# EasyEDA Pro project ProPrj_电力电子综合设计_2025-07-04.epro, schematic Schematic1_1
Board Name: BOOST; Create Date: 2025-06-15; Page Name: P1; Project Name: 电力电子综合设计; Schematic Name: Schematic1_1; Update Date: 2025-06-18; Company: 嘉立创EDA; Page Size: A4; Version: V1.0
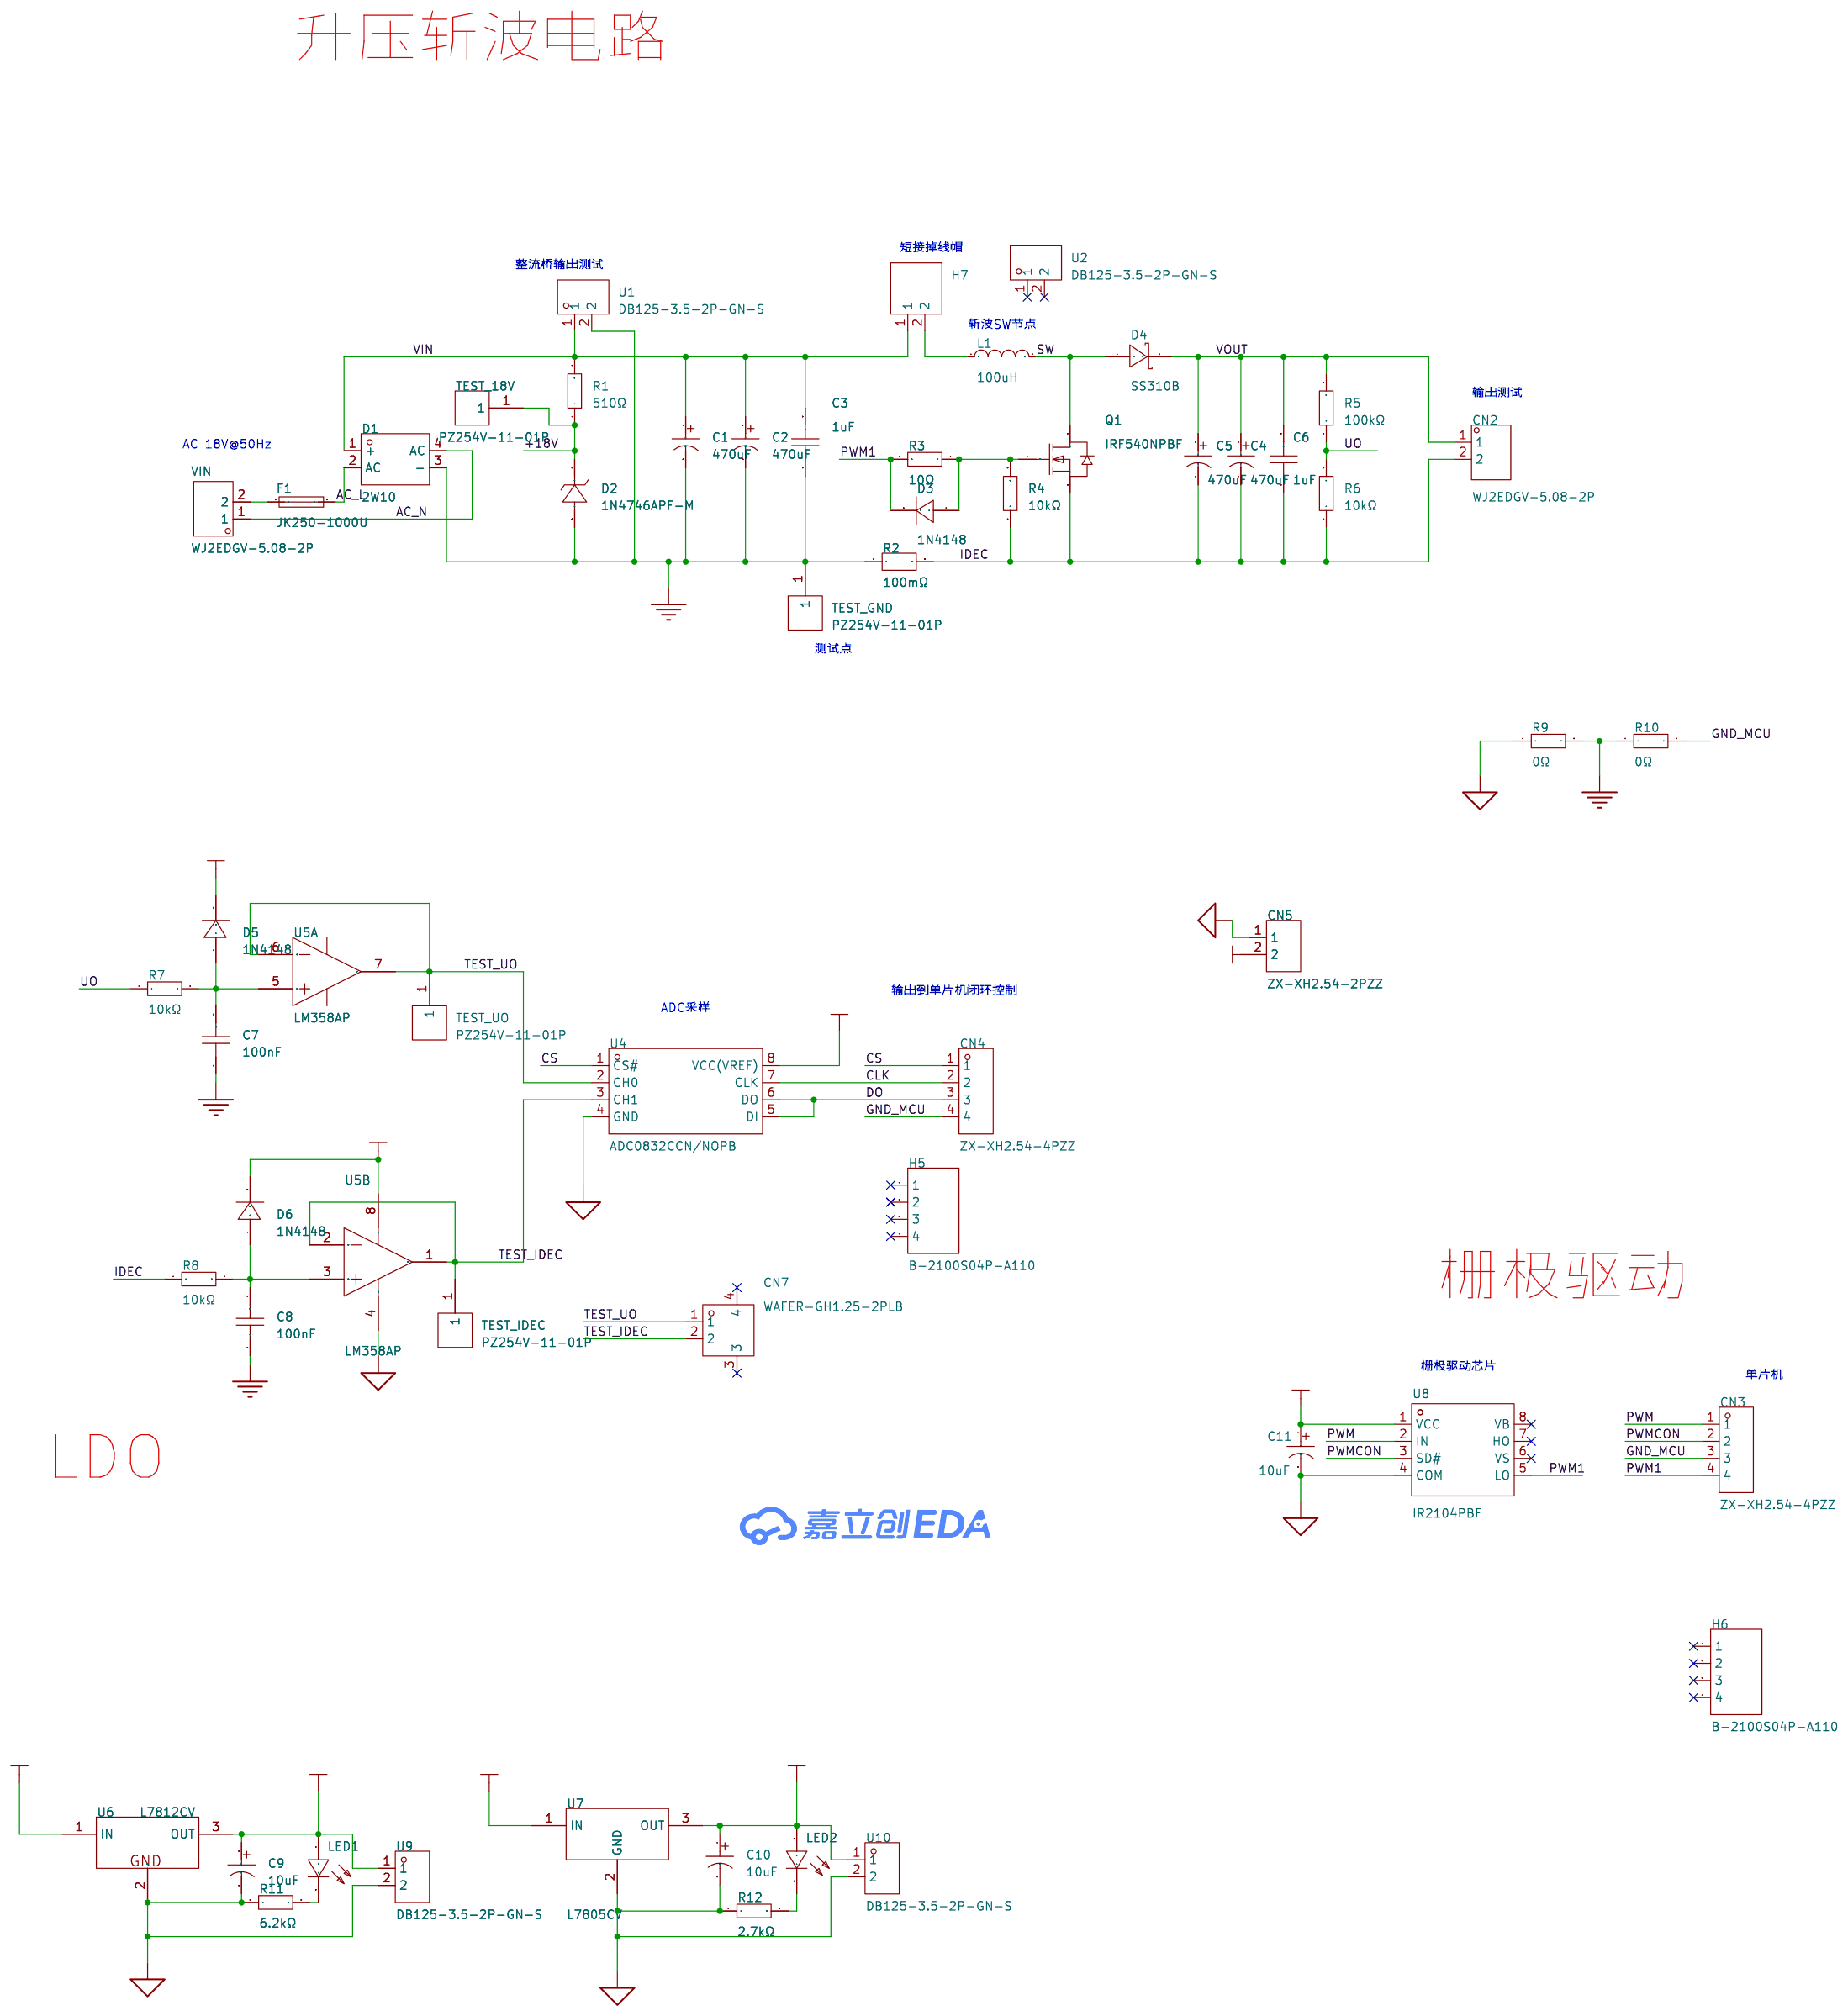
[diagram p1: schematic sheet]

## Parts
C1  470uF  [CAP-TH_BD16.0-P7.50-D1.2-FD]
C2  470uF  [CAP-TH_BD16.0-P7.50-D1.2-FD]
C3  1uF  [CAP-TH_L7.2-W6.0-P5.00-D0.6]
C4  470uF  [CAP-TH_BD16.0-P7.50-D1.2-FD]
C5  470uF  [CAP-TH_BD16.0-P7.50-D1.2-FD]
C6  1uF  [CAP-TH_L7.2-W6.0-P5.00-D0.6]
C7  100nF  [CAP-TH_L4.8-W3.2-P5.08-D1.2]
C8  100nF  [CAP-TH_L4.8-W3.2-P5.08-D1.2]
C9  10uF  [CAP-TH_BD5.0-P2.00-D0.8-FD]
C10  10uF  [CAP-TH_BD5.0-P2.00-D0.8-FD]
C11  10uF  [CAP-TH_BD5.0-P2.00-D0.8-FD]
CN2  WJ2EDGV-5.08-2P  [CONN-TH_WJ2EDGV-5.08-2P]
CN3  ZX-XH2.54-4PZZ  [CONN-TH_4P-P2.50_4PIN]
CN4  ZX-XH2.54-4PZZ  [CONN-TH_4P-P2.50_4PIN]
CN5  ZX-XH2.54-2PZZ  [CONN-TH_2P-P2.50_HX25003-2A]
CN7  WAFER-GH1.25-2PLB  [CONN-TH_2P-P1.25_XUNPU_WAFER-GH1.25-2PLB]
D1  2W10  [DIO-BG-TH_2W10]
D2  1N4746APF-M  [DO-41_BD2.8-L4.2-P8.20-D0.7-RD]
D3  1N4148  [DO-35_BD2.0-L4.0-P8.00-D0.5-FD]
D4  SS310B  [SMB_L4.6-W3.6-LS5.3-RD]
D5  1N4148  [DO-35_BD2.0-L4.0-P8.00-D0.5-FD]
D6  1N4148  [DO-35_BD2.0-L4.0-P8.00-D0.5-FD]
F1  JK250-1000U  [FUSE-TH_L20.0-W4.5-P5.10-D0.8-S3.00]
H5  B-2100S04P-A110  [HDR-TH_4P-P2.54-V-M]  (no BOM)
H6  B-2100S04P-A110  [HDR-TH_4P-P2.54-V-M]  (no BOM)
H7  -  [HDR-TH_2P-P2.54-V-M-1]
L1  100uH  [IND-SMD_L10.6-W10.2]
LED1  204-10SUGD/S400-A5  [LED-TH_BD3.0-P2.54-FD-GREEN]
LED2  204-10SUGD/S400-A5  [LED-TH_BD3.0-P2.54-FD-GREEN]
Q1  IRF540NPBF  [TO-220-3_L10.0-W4.5-P2.54-L]
R1  510Ω  [RES-TH_BD2.3-L6.5-P10.50-D0.5]
R2  100mΩ  [RES-TH_BD5.0-L15.5-P19.50-D0.7]
R3  10Ω  [RES-TH_BD2.4-L6.3-P10.30-D0.6]
R4  10kΩ  [RES-TH_BD2.3-L6.5-P10.50-D0.5]
R5  100kΩ  [RES-TH_BD2.5-L6.5-P10.50-D0.6]
R6  10kΩ  [RES-TH_BD2.3-L6.5-P10.50-D0.5]
R7  10kΩ  [RES-TH_BD2.3-L6.5-P10.50-D0.5]
R8  10kΩ  [RES-TH_BD2.3-L6.5-P10.50-D0.5]
R9  0Ω  [RES-TH_BD2.5-L6.5-P10.50-D0.6]
R10  0Ω  [RES-TH_BD2.5-L6.5-P10.50-D0.6]
R11  6.2kΩ  [RES-TH_BD2.2-L6.5-P10.50-D0.6]
R12  2.7kΩ  [RES-TH_BD2.5-L6.5-P10.50-D0.6]
TEST_18V  PZ254V-11-01P  [HDR-TH_1P-P2.54-V-M]
TEST_GND  PZ254V-11-01P  [HDR-TH_1P-P2.54-V-M]
TEST_IDEC  PZ254V-11-01P  [HDR-TH_1P-P2.54-V-M]
TEST_UO  PZ254V-11-01P  [HDR-TH_1P-P2.54-V-M]
U1  DB125-3.5-2P-GN-S  [CONN-TH_2P-P3.50_L7.4-W7.0]
U2  DB125-3.5-2P-GN-S  [CONN-TH_2P-P3.50_L7.4-W7.0]  (no BOM)
U4  ADC0832CCN/NOPB  [PDIP-8_L9.6-W6.4-P2.54-LS7.6-BL]
U5  LM358AP  [DIP-8_L9.7-W6.4-P2.54-LS7.6-BL]  (sections 1,2)
U6  L7812CV  [TO-220-3_L10.0-W4.5-P2.54-L]
U7  L7805CV  [TO-220-3_L10.0-W4.5-P2.54-L]
U8  IR2104PBF  [DIP-8_L9.9-W6.6-P2.54-LS7.62-BL]
U9  DB125-3.5-2P-GN-S  [CONN-TH_2P-P3.50_L7.4-W7.0]
U10  DB125-3.5-2P-GN-S  [CONN-TH_2P-P3.50_L7.4-W7.0]
VIN  WJ2EDGV-5.08-2P  [CONN-TH_WJ2EDGV-5.08-2P]

## Library data of the parts
C1 C2 C4 C5 = KM477M100K25RR0VH2FP0: 容值:470uF;精度:±20%;额定电压:100V;; LCSC Part Name: 470uF ±20% 100V; Supplier Part: C72551; Manufacturer: CX(承兴); Supplier Footprint: 插件,D16xL25mm; JLCPCB Part Class: 扩展库; Datasheet: https://atta.szlcsc.com/upload/public/pdf/source/20211027/06D6BA3719C264B639DC286D935D03EA.pdf; Supplier: LCSC; Tolerance: ±20%; Voltage Rating: 100V; Pin Spacing: 7.5mm; Diameter: 16mm; Height - Seated (Max): 25mm
C3 C6 = PE105J2A0501: 容值:1uF;精度:±5%;额定电压:100V;介电材料:金属化聚酯;工作温度:-40℃~+85℃;; LCSC Part Name: 1uF ±5% 100V; Supplier Part: C390180; Manufacturer: KYET(科雅); Supplier Footprint: 插件,P=5mm; JLCPCB Part Class: 扩展库; Datasheet: https://atta.szlcsc.com/upload/public/pdf/source/20250227/127161F181C047328E5CCC3478FF3F3E.pdf; Supplier: LCSC; Tolerance: ±5%; Voltage Rating: 100V; Dielectric Material: 金属化聚酯; Operating Temperature: -40℃~+85℃
C7 C8 = CT4G-0805-2X1-50V-0.1μF-K: 容值:100nF;精度:±10%;额定电压:50V;温度系数:-;; LCSC Part Name: 100nF ±10% 50V; Supplier Part: C141981; Manufacturer: TORCH(火炬); Supplier Footprint: 插件,P=5.08mm; JLCPCB Part Class: 扩展库; Datasheet: https://atta.szlcsc.com/upload/public/pdf/source/20180620/C141981_0E4048852A6BFF96618422C8126500A5.pdf; Supplier: LCSC; Tolerance: ±10%; Voltage Rating: 50V
C9-C11 = KF100M035C110A: 容值:10uF;精度:±20%;额定电压:35V;; LCSC Part Name: 10uF ±20% 35V; Supplier Part: C62621; Manufacturer: CapXon(丰宾); Supplier Footprint: 插件,D5xL11mm; JLCPCB Part Class: 扩展库; Datasheet: https://atta.szlcsc.com/upload/public/pdf/source/20151126/1457707596840.pdf; Supplier: LCSC; Tolerance: ±20%; Voltage Rating: 35V; Pin Spacing: 2mm; Diameter: 5mm; Height - Seated (Max): 11mm; Lifetime: 2000hrs@105℃
CN2 VIN = WJ2EDGV-5.08-2P: 连接器类型:板端/插座-开口;固定方式:-;结构:1x2P;间距:5.08mm;颜色:绿色;安装方式:直针;排数:1;每排PIN数:2;额定电流:20A;额定电压:450V;线规 - AWG:-;线规 - 平方毫米:-;触头材质:黄铜;触头镀层:锡;工作温度范围:-40℃~+105℃;焊接温度(最大值):-;; LCSC Part Name: 1x2P 5.08mm 排数:1 每排P数:2; Supplier Part: C8461; Manufacturer: KANGNEX(康奈克斯电气); Supplier Footprint: 插件,P=5.08mm; JLCPCB Part Class: 扩展库; Datasheet: https://atta.szlcsc.com/upload/public/pdf/source/20191225/C8461_177EB00EC60F9C1AD12B590D31C8666C.pdf; Supplier: LCSC; Connector Type: 板端/插座-开口; Structure: 1x2P; Pitch: 5.08mm; Color: 绿色; Mounting Style: 直针; Number of Pins: 2P; Number of Rows: 1; Number of PINs Per Row: 2; Current Rating (Max): 20A; Voltage Rating (Max): 450V; Contact Material: 黄铜; Contact Plating: 锡; Operating Temperature Range: -40℃~+105℃
CN3 CN4 = ZX-XH2.54-4PZZ: 插针结构:1x4P;间距:2.5mm;安装方式:直插;参考系列:XH;总PIN数:4P;排数:1;每排PIN数:4;行距:-;额定电流:3A;触头材质:黄铜;触头镀层:锡;工作温度范围:-25℃~+85℃;; LCSC Part Name: 1x4P 间距:2.5mm 直插 系列:XH; Supplier Part: C7429634; Manufacturer: Megastar(兆星); Supplier Footprint: 插件,P=2.5mm; JLCPCB Part Class: 扩展库; Datasheet: https://atta.szlcsc.com/upload/public/pdf/source/20230619/B529A2163E0159A644AB3383D208FB03.pdf; Supplier: LCSC; Pins Structure: 1x4P; Pitch: 2.5mm; Mounting Type: 直插; Reference Series: XH; Number of Pins: 4P; Number of Rows: 1; Number of PINs Per Row: 4; Rated Current: 3A; Contact Material: 黄铜; Contact Plating: 锡; Operating Temperature: -25℃~+85℃; Rated Voltage (Max): 250V; Plastic Material: PA66; Flame Retardant Rating: UL94V-0; Color: 白色; Z-Height of the Board: 7mm; X-Length of Bottom Edge on Board (Spacing Line): 12.5mm; Y-Width of Bottom Edge on Board: 5.9mm
CN5 = ZX-XH2.54-2PZZ: 插针结构:1x2P;间距:2.5mm;安装方式:直插;参考系列:XH;总PIN数:2P;排数:1;每排PIN数:2;行距:-;额定电流:3A;触头材质:黄铜;触头镀层:锡;工作温度范围:-25℃~+85℃;; LCSC Part Name: 1x2P 间距:2.5mm 直插 系列:XH; Supplier Part: C7429632; Manufacturer: Megastar(兆星); Supplier Footprint: 插件,P=2.5mm; JLCPCB Part Class: 扩展库; Datasheet: https://atta.szlcsc.com/upload/public/pdf/source/20230619/19BA6947230AA44A04D3EDD65E618FD0.pdf; Supplier: LCSC; Pins Structure: 1x2P; Pitch: 2.5mm; Mounting Type: 直插; Reference Series: XH; Number of Pins: 2P; Number of Rows: 1; Number of PINs Per Row: 2; Rated Current: 3A; Contact Material: 黄铜; Contact Plating: 锡; Operating Temperature: -25℃~+85℃; Rated Voltage (Max): 250V; Plastic Material: PA66; Flame Retardant Rating: UL94V-0; Color: 白色; Z-Height of the Board: 7mm; X-Length of Bottom Edge on Board (Spacing Line): 7.5mm; Y-Width of Bottom Edge on Board: 5.9mm
CN7 = WAFER-GH1.25-2PLB: 插针结构:1x2P;间距:1.25mm;安装方式:立贴;参考系列:GH;总PIN数:2P;排数:1;每排PIN数:2;行距:-;额定电流:1A;触头材质:黄铜;触头镀层:-;工作温度:-25℃~+85℃;; LCSC Part Name: 1x2P 间距:1.25mm 立贴 系列:GH; Supplier Part: C3029368; Manufacturer: XUNPU(讯普); Supplier Footprint: SMD,P=1.25mm; JLCPCB Part Class: 扩展库; Datasheet: https://atta.szlcsc.com/upload/public/pdf/source/20220527/44F824AAC8C2B617205E15955FF9C23D.pdf; Supplier: LCSC; Pins Structure: 1x2P; Pitch: 1.25mm; Mounting Type: 立贴; Reference Series: GH; Number of Pins: 2P; Number of Rows: 1; Number of PINs Per Row: 2; Current Rating: 1A; Contact Material: 黄铜; Operating Temperature: -25℃~+85℃; Voltage Rating: 125V; Plastic Material: LCP; Supplementary Features: 辅助焊脚; Color: 米色; Z-Height of the Board: 4.2mm; X-Length of Bottom Edge on Board (Spacing Line): 5.75mm; Y-Width of Bottom Edge on Board: 4.95mm
D1 = 2W10_C3064: 正向压降(Vf):1V@2A;直流反向耐压(Vr):1kV;整流电流:2A;正向浪涌电流(Ifsm):50A;; Supplier Part: C3064; Manufacturer: MDD(辰达半导体); Supplier Footprint: WOM; JLCPCB Part Class: 扩展库; Datasheet: https://atta.szlcsc.com/upload/public/pdf/source/20240809/6BA6F435CD69DB5BCB9EE3C8732FD91E.pdf; Supplier: LCSC; Voltage - Forward(Vf@If): 1V@2A; Voltage - DC Reverse(Vr): 1kV; Current - Rectified: 2A; Reverse Leakage Current (Ir): 10uA@1kV; Peak Forward Surge Current: 50A; Operating Temperature: -55℃~+125℃@(Tj)
D2 = 1N4746APF-M: Supplier Part: C7497924; Manufacturer: ST(先科); Supplier Footprint: DO-41; JLCPCB Part Class: 扩展库; Datasheet: https://atta.szlcsc.com/upload/public/pdf/source/20230815/F3027D200352FBEA986FB06BDB48B800.pdf; Supplier: LCSC
D3 D5 D6 = 1N4148_C14516: 二极管配置:-;正向压降(Vf):1V@10mA;直流反向耐压(Vr):75V;整流电流:-;反向恢复时间(Trr):-;; Supplier Part: C14516; Manufacturer: ST(先科); Supplier Footprint: DO-35; JLCPCB Part Class: 扩展库; Datasheet: https://atta.szlcsc.com/upload/public/pdf/source/20140303/1457707005030.pdf; Supplier: LCSC; Voltage - Forward(Vf@If): 1V@10mA; Voltage - DC Reverse(Vr): 75V; Reverse Leakage Current (Ir): 5uA@75V
D4 = SS310B_C14281: 二极管配置:独立式;正向压降(Vf):850mV@3A;直流反向耐压(Vr):100V;整流电流:3A;; LCSC Part Name: 电压:100V 电流:3A; Supplier Part: C14281; Manufacturer: MDD(辰达半导体); Supplier Footprint: SMB(DO-214AA); JLCPCB Part Class: 扩展库; Datasheet: https://atta.szlcsc.com/upload/public/pdf/source/20241121/2D46770803966DF119171D1C653E29F2.pdf; Supplier: LCSC; Diode Configuration: 独立式; Voltage - Forward(Vf@If): 850mV@3A; Voltage - DC Reverse(Vr): 100V; Current - Rectified: 3A; Reverse Leakage Current (Ir): 300uA@100V
F1 = JK250-1000U: 耐压:250V;最大电流:7A;保持电流(Ih):1A;跳闸电流:2A;; LCSC Part Name: 250V 1A 插件自恢复; Supplier Part: C369137; Manufacturer: JK(金科); Supplier Footprint: 插件,P=5.1mm; JLCPCB Part Class: 扩展库; Datasheet: https://atta.szlcsc.com/upload/public/pdf/source/20190729/C369139_C08718BF598B8E672A40D8E717FCB467.pdf; Supplier: LCSC; Voltage - Max: 250V; Current - Max: 7A; Hold Current: 1A; Trip Current: 2A; Time to Trip(Max): 20s
H5 H6 = B-2100S04P-A110: 插针结构:1x4P;间距:2.54mm;行距:-;圆针/方针:-;安装方式:直插;排数:单排;总PIN位数:4P;额定电流:-;额定电压:-;配合针长度:6mm;塑高:2.54mm;端接针长度:3mm;触头材质:黄铜;触头镀层:-;工作温度:-40℃~+105℃;颜色:黑色;; LCSC Part Name: 1x4P 间距:2.54mm 直插; Supplier Part: C124378; Manufacturer: Ckmtw(灿科盟); Supplier Footprint: 插件,P=2.54mm; JLCPCB Part Class: 扩展库; Datasheet: https://atta.szlcsc.com/upload/public/pdf/source/20170821/C124381_1503303309126901535.pdf; Supplier: LCSC; Pin Structure: 1x4P; Pitch: 2.54mm; Mounting Type: 直插; Number of Rows: 单排; Number of Pins: 4P; Length of Mating Pin: 6mm; Insulation Height: 2.54mm; Length of End Connection Pin: 3mm; Contact Material: 黄铜; Operating Temperature: -40℃~+105℃; Color: 黑色
H7 = HDR-M_2.54_1x2P: Supplier Part: C124375; Supplier Footprint: 插件
L1 = PSPMAC1045H-101M-ANP: 电感值:100uH;精度:±20%;额定电流:2A;饱和电流(Isat):4A;; LCSC Part Name: 100uH ±20% 4A; Supplier Part: C436577; Manufacturer: PROD(谱罗德); Supplier Footprint: SMD,11x10mm; JLCPCB Part Class: 扩展库; Datasheet: https://atta.szlcsc.com/upload/public/pdf/source/20200813/C436577_6C03ADCEB86EDF89C439410E6AAFAED5.pdf; Supplier: LCSC; Tolerance: ±20%; Rated Current: 2A; Saturation Current (Isat): 4A; DC Resistance (DCR): 300mΩ; Ratings: AEC-Q200
LED1 LED2 = 204-10SUGD/S400-A5: 灯头类型:3mm圆形灯头;发光颜色:翠绿色;功率:110mW;正向电流:20mA;主波长:530nm;二极管配置:-;透镜颜色:雾状绿透镜;色温:-;发光角度:30°;载带方式:-;工作温度:-40℃~+85℃;; LCSC Part Name: 翠绿; Supplier Part: C99761; Manufacturer: EVERLIGHT(亿光); Supplier Footprint: 插件,D=3mm; JLCPCB Part Class: Extended Part; Datasheet: https://atta.szlcsc.com/upload/public/pdf/source/20231222/11ECFE5D50388BB9885CDCD9350FD859.pdf; Supplier: LCSC; Lamp Holder Type: 3mm圆形灯头; Emitted Color: 翠绿色; Power Dissipation: 110mW; Forward Current: 20mA; Dominant Wavelength: 530nm; Peak Wavelength: 525nm; Lens Color: 雾状绿透镜; Viewing Angle: 30°; Operating Temperature: -40℃~+85℃
Q1 = IRF540NPBF: 类型:1个N沟道;漏源电压(Vdss):100V;连续漏极电流(Id):33A;导通电阻(RDS(on)@Vgs,Id):44mΩ@10V,16A;功率(Pd):130W;阈值电压(Vgs(th)@Id):4V@250uA;; LCSC Part Name: 1个N沟道 耐压:100V 电流:33A; Supplier Part: C2566; Manufacturer: Infineon(英飞凌); Supplier Footprint: TO-220AB; JLCPCB Part Class: Extended Part; Datasheet: https://atta.szlcsc.com/upload/public/pdf/source/20140818/1457707225950.pdf; Supplier: LCSC; Type: 1个N沟道; Drain Source Voltage (Vdss): 100V; Continuous Drain Current (Id): 33A; Drain Source On Resistance (RDS(on)@Vgs,Id): 44mΩ@10V,16A; Power Dissipation (Pd): 130W; Gate Threshold Voltage (Vgs(th)@Id): 4V@250uA; Total Gate Charge (Qg@Vgs): 71nC; Input Capacitance (Ciss@Vds): 1.96nF; Reverse Transfer Capacitance (Crss@Vds): 40pF; Operating Temperature: -55℃~+175℃
R1 = MF1/4W-510Ω±1% T: 电阻类型:金属膜电阻;阻值:510Ω;精度:±1%;功率:250mW;温度系数:±100ppm/℃;; LCSC Part Name: 510Ω ±1% 250mW 金属膜电阻; Supplier Part: C119318; Manufacturer: CCO(千志电子); Supplier Footprint: 插件,D2.3xL6.5mm; JLCPCB Part Class: 扩展库; Datasheet: https://atta.szlcsc.com/upload/public/pdf/source/20190910/C427326_62A6D058BC0FF74963A2F22379CA06CE.pdf; Supplier: LCSC; Type: 金属膜电阻; Tolerance: ±1%; Voltage-Supply(Max): 250V; Power(Watts): 250mW; Temperature Coefficient: ±100ppm/℃; Operating Temperature: -55℃~+155℃
R2 = MF3WS-0.1Ω±1%T: 电阻类型:金属膜电阻;阻值:100mΩ;精度:±1%;功率:3W;温度系数:±200ppm/℃;; LCSC Part Name: 金属膜电阻 100mΩ ±1% 3W; Supplier Part: C714162; Manufacturer: 华星机电; Supplier Footprint: 插件,D5xL15.5mm; JLCPCB Part Class: 扩展库; Datasheet: https://atta.szlcsc.com/upload/public/pdf/source/20200731/C713882_AE8EB1102749D7E4FB4FB13DC898C429.pdf; Supplier: LCSC; Type: 金属膜电阻; Tolerance: ±1%; Power(Watts): 3W; Temperature Coefficient: ±200ppm/℃
R3 = MFR-25JT-52-10R: 电阻类型:金属膜电阻;阻值:10Ω;精度:±5%;功率:250mW;; LCSC Part Name: 金属膜电阻 10Ω ±5% 250mW 铜脚，圆柱状直插; Supplier Part: C176452; Manufacturer: YAGEO(国巨); Supplier Footprint: 插件,D2.4xL6.3mm; JLCPCB Part Class: 扩展库; Datasheet: https://atta.szlcsc.com/upload/public/pdf/source/20191118/C457825_18355E864DE4965678DC27B0EBC3E21E.pdf; Supplier: LCSC; Type: 金属膜电阻; Tolerance: ±5%; Power(Watts): 250mW; Operating Temperature: -55℃~+155℃
R4 R6-R8 = MF1/4W-10KΩ±1% T: 电阻类型:金属膜电阻;阻值:10kΩ;精度:±1%;功率:250mW;温度系数:±100ppm/℃;; LCSC Part Name: 10kΩ ±1% 250mW 金属膜电阻 圆柱状直插; Supplier Part: C119347; Manufacturer: CCO(千志电子); Supplier Footprint: 插件,D2.3xL6.5mm; JLCPCB Part Class: 扩展库; Datasheet: https://atta.szlcsc.com/upload/public/pdf/source/20190910/C427326_62A6D058BC0FF74963A2F22379CA06CE.pdf; Supplier: LCSC; Type: 金属膜电阻; Tolerance: ±1%; Voltage-Supply(Max): 250V; Power(Watts): 250mW; Temperature Coefficient: ±100ppm/℃; Operating Temperature: -55℃~+155℃
R5 = MFR0W4F1003A50: 电阻类型:金属膜电阻;阻值:100kΩ;精度:±1%;功率:250mW;温度系数:±50ppm/℃;; LCSC Part Name: 100kΩ ±1% 250mW 金属膜电阻 铜脚，圆柱状直插; Supplier Part: C58597; Manufacturer: UNI-ROYAL(厚声); Supplier Footprint: 插件,D2.2xL6.5mm; JLCPCB Part Class: 扩展库; Datasheet: https://atta.szlcsc.com/upload/public/pdf/source/20191012/C436293_8820AA14BC71FA35E551C06C441482A0.pdf; Supplier: LCSC; Type: 金属膜电阻; Tolerance: ±1%; Voltage-Supply(Max): 250V; Power(Watts): 250mW; Temperature Coefficient: ±50ppm/℃
R9 R10 = RN1/4W0RT/BA1: 电阻类型:金属膜电阻;阻值:0Ω;精度:±1%;功率:250mW;; LCSC Part Name: 金属膜电阻 0Ω ±1% 250mW; Supplier Part: C410698; Manufacturer: Tyohm(幸亚电阻); Supplier Footprint: 插件,D2.4xL6.5mm; JLCPCB Part Class: 扩展库; Datasheet: https://atta.szlcsc.com/upload/public/pdf/source/20190808/C410699_D126E64D28B638F1D73B58E9F61DFD9B.pdf; Supplier: LCSC; Type: 金属膜电阻; Tolerance: ±1%; Power(Watts): 250mW
R11 = MFR0W4F6201A50: 电阻类型:金属膜电阻;阻值:6.2kΩ;精度:±1%;功率:250mW;温度系数:±50ppm/℃;; LCSC Part Name: 6.2kΩ ±1% 250mW 金属膜电阻 铜脚，圆柱状直插; Supplier Part: C61652; Manufacturer: UNI-ROYAL(厚声); Supplier Footprint: 插件,D2.2xL6.5mm; JLCPCB Part Class: 扩展库; Datasheet: https://atta.szlcsc.com/upload/public/pdf/source/20191012/C436293_8820AA14BC71FA35E551C06C441482A0.pdf; Supplier: LCSC; Type: 金属膜电阻; Tolerance: ±1%; Voltage-Supply(Max): 250V; Power(Watts): 250mW; Temperature Coefficient: ±50ppm/℃
R12 = MFR0W4F2701A50: 电阻类型:金属膜电阻;阻值:2.7kΩ;精度:±1%;功率:250mW;温度系数:±50ppm/℃;; LCSC Part Name: 2.7kΩ ±1% 250mW 金属膜电阻; Supplier Part: C58615; Manufacturer: UNI-ROYAL(厚声); Supplier Footprint: 插件,D2.2xL6.5mm; JLCPCB Part Class: 扩展库; Datasheet: https://atta.szlcsc.com/upload/public/pdf/source/20191012/C436293_8820AA14BC71FA35E551C06C441482A0.pdf; Supplier: LCSC; Type: 金属膜电阻; Tolerance: ±1%; Voltage-Supply(Max): 250V; Power(Watts): 250mW; Temperature Coefficient: ±50ppm/℃
TEST_18V TEST_GND TEST_IDEC TEST_UO = PZ254V-11-01P: 插针结构:1x1P;间距:2.54mm;行距:-;圆针/方针:方针;安装方式:直插;排数:单排;总PIN位数:1P;额定电流:-;额定电压:-;配合针长度:6mm;塑高:2.5mm;端接针长度:3mm;触头材质:黄铜;触头镀层:-;工作温度:-40℃~+105℃;颜色:黑色;; LCSC Part Name: 1x1P 间距:2.54mm 方针 直插; Supplier Part: C492400; Manufacturer: XFCN(兴飞); Supplier Footprint: 插件,P=2.54mm; JLCPCB Part Class: 扩展库; Datasheet: https://atta.szlcsc.com/upload/public/pdf/source/20200309/C492400_46876A5B545F5AE6B8D4A09C46E276E8.pdf; Supplier: LCSC; Pin Structure: 1x1P; Pitch: 2.54mm; Circluar Pins/Square Pins: 方针; Mounting Type: 直插; Number of Rows: 单排; Number of Pins: 1P; Length of Mating Pin: 6mm; Insulation Height: 2.5mm; Length of End Connection Pin: 3mm; Contact Material: 黄铜; Operating Temperature: -40℃~+105℃; Color: 黑色
U1 U2 U9 U10 = DB125-3.5-2P-GN-S: 结构:1x2P;间距:3.5mm;颜色:绿色;安装方式:直插;排数:1;每排PIN数:2;额定电流:10A;额定电压:300V;线规 - AWG:16~28;线规 - 平方毫米:1;工作温度:-40℃~+105℃;; LCSC Part Name: 1x2P 3.5mm 直插 排数:1 每排P数:2; Supplier Part: C466970; Manufacturer: DORABO(地博电气); Supplier Footprint: 插件,P=3.5mm; JLCPCB Part Class: 扩展库; Datasheet: https://atta.szlcsc.com/upload/public/pdf/source/20221227/3B943AA1CFCAE24F1BA4E72404938A89.pdf; Supplier: LCSC; Number of Positions or Pins: 1x2P; Pitch: 3.5mm; Color: 绿色; Mounting Type: 直插; Number of Pins: 2P; Number of Rows: 1; Number of PINs Per Row: 2; Screw Specification: M2; Current Rating: 10A; Voltage Rating (Max): 300V; Wire Gauge - AWG: 16~28; Wire Gauge - mm2: 1; Operating Temperature: -40℃~+105℃
U4 = ADC0832CCN/NOPB: 分辨率:8位;采样率:-;工作电压:4.5V~6.3V;接口类型:MICROWIRE;; LCSC Part Name: ADC0832CCN/NOPB 停产; Supplier Part: C385862; Manufacturer: TI(德州仪器); Supplier Footprint: PDIP-8; JLCPCB Part Class: 扩展库; Datasheet: https://www.ti.com/cn/lit/gpn/adc0832-n; Supplier: LCSC; resolution: 8位; number of channels: 2; Supply Voltage: 4.5V~6.3V; Interface: MICROWIRE; differential input: 是; Integral nonlinearity: 1LSB; Operating Temperature: -40℃~+85℃
U5 = LM358AP: 放大器数:双路;增益带宽积(GBP):700kHz;输入偏置电流(Ib):15nA;压摆率(SR):0.3V/us;带宽(-3db):-;; LCSC Part Name: 行业标准双路运算放大器; Supplier Part: C163528; Manufacturer: TI(德州仪器); Supplier Footprint: DIP-8; JLCPCB Part Class: 扩展库; Datasheet: https://www.ti.com/cn/lit/gpn/lm358a; Supplier: LCSC; Number of Circuits: 双路; Gain Bandwidth Product(GBP): 700kHz; Current - Input Bias(Ib): 15nA; Slew Rate(SR): 0.3V/us; Output Current: 40mA; Operating Temperature: 0℃~+70℃
U6 = L7812CV_C519078: 输出类型:固定;工作电压:35V;输出电压:12V;输出电流:1.2A;电源纹波抑制比(PSRR):71dB@(120Hz);输出极性:正极;; LCSC Part Name: 1.2A 宽输入电压固定电压稳压器; Supplier Part: C519078; Manufacturer: HGC(华冠); Supplier Footprint: TO-220; JLCPCB Part Class: 扩展库; Datasheet: https://atta.szlcsc.com/upload/public/pdf/source/20200427/C519075_B339EB95789D71CBB6AC413ABED62D06.pdf; Supplier: LCSC; Output Type: 固定; Voltage - Supply: 35V; Output Voltage: 12V; Output Current: 1.2A; Power Supply Rejection Ratio (PSRR): 71dB@(120Hz); Operating Temperature: 0℃~+125℃@(Tj); Output Configuration: 正极; Number of Outputs: 1
U7 = L7805CV: 输出类型:固定;工作电压:35V;输出电压:5V;输出电流:1.5A;电源纹波抑制比(PSRR):62dB@(120Hz);输出极性:正极;; LCSC Part Name: 正稳压器IC; Supplier Part: C111887; Manufacturer: ST(意法半导体); Supplier Footprint: TO-220; JLCPCB Part Class: 扩展库; Datasheet: https://atta.szlcsc.com/upload/public/pdf/source/20180606/C192854_20B6D8F8F52B6FFCE5644906251095FD.pdf; Supplier: LCSC; Output Type: 固定; Maximum Input Voltage: 35V; Output Voltage: 5V; Output Current: 1.5A; Power Supply Rejection Ratio (PSRR): 62dB@(120Hz); Dropout Voltage: 2V@(1A); standby current: 8mA; Feature: 短路保护；热保护(TSD)；过流保护(OCP); Operating Temperature: 0℃~+125℃; Output Polarity: 正极; Number of Outputs: 1
U8 = IR2104PBF: 驱动配置:半桥;负载类型:MOSFET；IGBT;驱动通道数:2;峰值灌电流:360mA;峰值拉电流:210mA;电源电压:10V~20V;上升时间:100ns;下降时间:50ns;; LCSC Part Name: IR2104PBF 停产; Supplier Part: C2959; Manufacturer: Infineon(英飞凌); Supplier Footprint: PDIP-8; JLCPCB Part Class: 扩展库; Datasheet: https://atta.szlcsc.com/upload/public/pdf/source/20140906/1457707236579.pdf; Supplier: LCSC; Driven Configuration: 半桥; Load Type: MOSFET；IGBT; Number of Drivers: 2; Peak Output Current(sink): 360mA; Peak Output Current(source): 210mA; Supply Voltage: 10V~20V; Rise Time: 100ns; Fall Time: 50ns; Operating Temperature: -40℃~+150℃@(Tj)

## Nets
+5V: C10.1 CN5.2 D5.2(C) D6.2(C) LED2.1(A) U4.8(VCC(VREF)) U5.8(VCC) U7.3(OUT) U10.1
+12V: C9.1 C11.1 LED1.1(A) U6.3(OUT) U7.1(IN) U8.1(VCC) U9.1
+18V: D2.1(K) R1.1 TEST_18V.1 U6.1(IN)
AGND: C9.2 C10.2 C11.2 CN5.1 R9.1 R11.1 R12.1 U4.4(GND) U5.4(GND) U6.2(GND) U7.2(GND) U8.4(COM) U9.2 U10.2
GND: C1.2 C2.2 C3.1 C7.1 C8.1 D1.3(-) D2.2(A) R2.1 R9.2 R10.1 TEST_GND.1 U1.2
GND_MCU: CN3.3 CN4.4 R10.2
VIN: C1.1 C2.1 C3.2 D1.1(+) H7.1 R1.2 U1.1
AC_L: D1.2(AC) F1.2
AC_N: D1.4(AC) VIN.1
CLK: CN4.2 U4.7(CLK)
CS: CN4.1 U4.1(CS#)
DO: CN4.3 U4.5(DI) U4.6(DO)
IDEC: C4.2 C5.2 C6.1 CN2.2 Q1.3(S) R2.2 R4.1 R6.1 R8.1
PWM: CN3.1 U8.2(IN)
PWM1: CN3.4 D3.2(C) R3.1 U8.5(LO)
PWMCON: CN3.2 U8.3(SD#)
SW: D4.2(A) L1.2 Q1.2(D)
TEST_IDEC: CN7.2 TEST_IDEC.1 U4.3(CH1) U5.1(OUTA) U5.2(INA-)
TEST_UO: CN7.1 TEST_UO.1 U4.2(CH0) U5.6(INB-) U5.7(OUTB)
UO: R5.1 R6.2 R7.1
VOUT: C4.1 C5.1 C6.2 CN2.1 D4.1(K) R5.2
$1N366: F1.1 VIN.2
$1N1800: H7.2 L1.1
$1N2114: D3.1(A) Q1.1(G) R3.2 R4.2
$1N3292: C7.2 D5.1(A) R7.2 U5.5(INB+)
$1N4224: C8.2 D6.1(A) R8.2 U5.3(INA+)
$1N5009: LED1.2(K) R11.2
$1N5371: LED2.2(K) R12.2

Not connected (* = marked no-connect by the designer): CN7 3* 4*; H5 1* 2* 3* 4*; H6 1* 2* 3* 4*; U2 1* 2*; U8 6(VS)* 7(HO)* 8(VB)*

## Notes on the sheet
- 升压斩波电路
- 短接掉线帽
- 整流桥输出测试
- 斩波SW节点
- 输出测试
- AC 18V@50Hz
- 测试点
- 输出到单片机闭环控制
- ADC采样
- 栅极驱动
- 栅极驱动芯片
- 单片机
- LDO
